# Altium schematic sheet inverter_sch.SchDoc
size A3
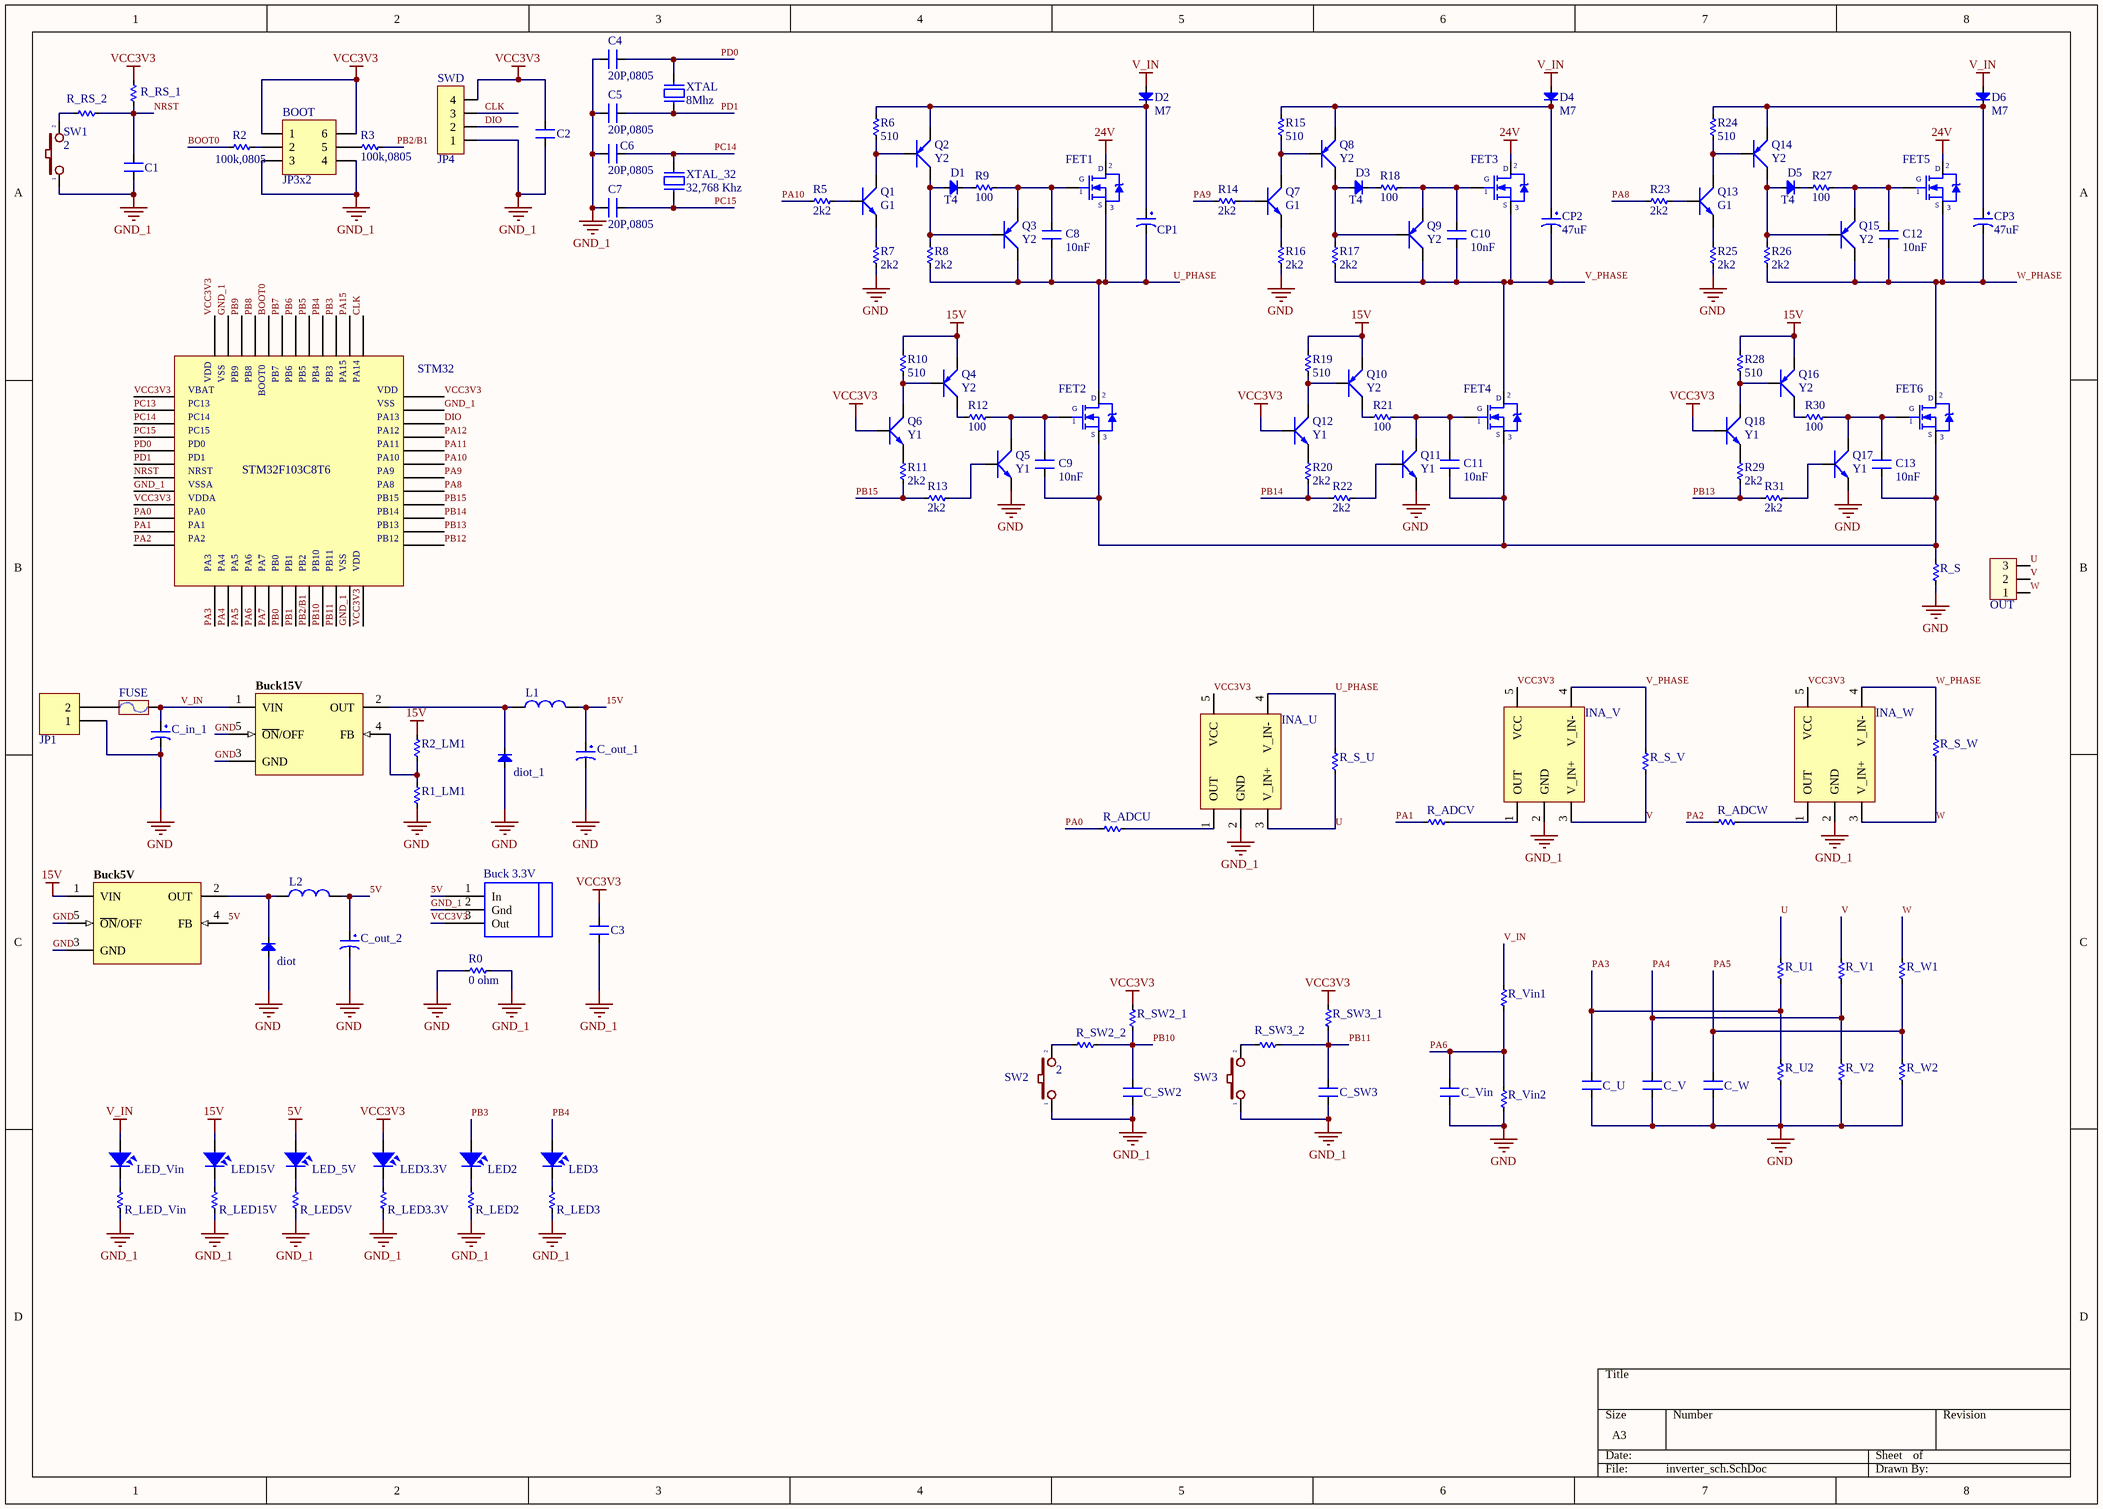
[diagram p0: inverter_sch.SchDoc]

## Parts
BOOT  JP3x2  [JP3-D2T]
Buck5V  LM2576  [TO263]  (value not drawn)
Buck15V  LM2576  [TO263]  (value not drawn)
Buck_3.3V  LM3940-3.3  [SOT223]  (value not drawn)
C1  104,0805  [CN-SMD-0805]  (value not drawn)
C2  104,0805  [CN-SMD-0805]  (value not drawn)
C3  104,0805  [CN-SMD-0805]  (value not drawn)
C4  20P,0805  [CN-SMD-0805]
C5  20P,0805  [CN-SMD-0805]
C6  20P,0805  [CN-SMD-0805]
C7  20P,0805  [CN-SMD-0805]
C8  10nF  [CN-SMD-0805]
C9  10nF  [CN-SMD-0805]
C10  10nF  [CN-SMD-0805]
C11  10nF  [CN-SMD-0805]
C12  10nF  [CN-SMD-0805]
C13  10nF  [CN-SMD-0805]
C_in_1  100uF  [CP1.5/3.4]  (value not drawn)
C_out_1  100uF  [CP1.5/3.4]  (value not drawn)
C_out_2  100uF  [CP1.5/3.4]  (value not drawn)
C_SW2  104,0805  [CN-SMD-0805]  (value not drawn)
C_SW3  104,0805  [CN-SMD-0805]  (value not drawn)
C_U  XXpF  [CN-SMD-0805]  (value not drawn)
C_V  XXpF  [CN-SMD-0805]  (value not drawn)
C_Vin  XXpF  [CN-SMD-0805]  (value not drawn)
C_W  XXpF  [CN-SMD-0805]  (value not drawn)
CP1  47uF  [CP1/2]  (value not drawn)
CP2  47uF  [CP1/2]
CP3  47uF  [CP1/2]
D1  T4  [DIO-SMD-106]
D2  M7  [DIO-SMD-106]
D3  T4  [DIO-SMD-106]
D4  M7  [DIO-SMD-106]
D5  T4  [DIO-SMD-106]
D6  M7  [DIO-SMD-106]
diot  Diode SMD  [DIO-SMD-106]  (value not drawn)
diot_1  Diode SMD  [DIO-SMD-106]  (value not drawn)
FET1  STP80NF70  [QTO-220]  (value not drawn)
FET2  STP80NF70  [QTO-220]  (value not drawn)
FET3  STP80NF70  [QTO-220]  (value not drawn)
FET4  STP80NF70  [QTO-220]  (value not drawn)
FET5  STP80NF70  [QTO-220]  (value not drawn)
FET6  STP80NF70  [QTO-220]  (value not drawn)
FUSE  F1A  [Fuse1]  (value not drawn)
INA_U  INA193_4_5  [SOT95_SOT23]  (value not drawn)
INA_V  INA193_4_5  [SOT95_SOT23]  (value not drawn)
INA_W  INA193_4_5  [SOT95_SOT23]  (value not drawn)
JP1  Header 2_1  [HED2]  (value not drawn)
L1  100mH  [L/0.4]  (value not drawn)
L2  100mH  [L/0.4]  (value not drawn)
LED2  power 0805  [LED-0805-Blue]  (value not drawn)
LED3  power 0805  [LED-0805-Blue]  (value not drawn)
LED3.3V  power 0805  [LED-0805-Blue]  (value not drawn)
LED15V  power 0805  [LED-0805-Blue]  (value not drawn)
LED_5V  power 0805  [LED-0805-Blue]  (value not drawn)
LED_Vin  power 0805  [LED-0805-Blue]  (value not drawn)
OUT  Header 3  [HED3B]  (value not drawn)
Q1  G1  [SOT23B]
Q2  Y2  [SOT23B]
Q3  Y2  [SOT23B]
Q4  Y2  [SOT23B]
Q5  Y1  [SOT23B]
Q6  Y1  [SOT23B]
Q7  G1  [SOT23B]
Q8  Y2  [SOT23B]
Q9  Y2  [SOT23B]
Q10  Y2  [SOT23B]
Q11  Y1  [SOT23B]
Q12  Y1  [SOT23B]
Q13  G1  [SOT23B]
Q14  Y2  [SOT23B]
Q15  Y2  [SOT23B]
Q16  Y2  [SOT23B]
Q17  Y1  [SOT23B]
Q18  Y1  [SOT23B]
R0  0 ohm  [RES-SMD-1206]
R1_LM1  Res  [RES-SMD-0805]  (value not drawn)
R2  100k,0805  [RES-SMD-0805]
R2_LM1  Res  [RES-SMD-0805]  (value not drawn)
R3  100k,0805  [RES-SMD-0805]
R5  2k2  [RES-SMD-0805]
R6  510  [RES-SMD-0805]
R7  2k2  [RES-SMD-0805]
R8  2k2  [RES-SMD-0805]
R9  100  [RES-SMD-0805]
R10  510  [RES-SMD-0805]
R11  2k2  [RES-SMD-0805]
R12  100  [RES-SMD-0805]
R13  2k2  [RES-SMD-0805]
R14  2k2  [RES-SMD-0805]
R15  510  [RES-SMD-0805]
R16  2k2  [RES-SMD-0805]
R17  2k2  [RES-SMD-0805]
R18  100  [RES-SMD-0805]
R19  510  [RES-SMD-0805]
R20  2k2  [RES-SMD-0805]
R21  100  [RES-SMD-0805]
R22  2k2  [RES-SMD-0805]
R23  2k2  [RES-SMD-0805]
R24  510  [RES-SMD-0805]
R25  2k2  [RES-SMD-0805]
R26  2k2  [RES-SMD-0805]
R27  100  [RES-SMD-0805]
R28  510  [RES-SMD-0805]
R29  2k2  [RES-SMD-0805]
R30  100  [RES-SMD-0805]
R31  2k2  [RES-SMD-0805]
R_ADCU  Res  [RES-SMD-0805]  (value not drawn)
R_ADCV  Res  [RES-SMD-0805]  (value not drawn)
R_ADCW  Res  [RES-SMD-0805]  (value not drawn)
R_LED2  510,0805  [RES-SMD-0805]  (value not drawn)
R_LED3  510,0805  [RES-SMD-0805]  (value not drawn)
R_LED3.3V  510,0805  [RES-SMD-0805]  (value not drawn)
R_LED5V  510,0805  [RES-SMD-0805]  (value not drawn)
R_LED15V  510,0805  [RES-SMD-0805]  (value not drawn)
R_LED_Vin  510,0805  [RES-SMD-0805]  (value not drawn)
R_RS_1  10k,0805  [RES-SMD-0805]  (value not drawn)
R_RS_2  10k,0805  [RES-SMD-0805]  (value not drawn)
R_S  Res  [RES-SMD-2512]  (value not drawn)
R_S_U  Res  [RES-SMD-2512]  (value not drawn)
R_S_V  Res  [RES-SMD-2512]  (value not drawn)
R_S_W  Res  [RES-SMD-2512]  (value not drawn)
R_SW2_1  10k,0805  [RES-SMD-0805]  (value not drawn)
R_SW2_2  10k,0805  [RES-SMD-0805]  (value not drawn)
R_SW3_1  10k,0805  [RES-SMD-0805]  (value not drawn)
R_SW3_2  10k,0805  [RES-SMD-0805]  (value not drawn)
R_U1  Res  [RES-SMD-0805]  (value not drawn)
R_U2  Res  [RES-SMD-0805]  (value not drawn)
R_V1  Res  [RES-SMD-0805]  (value not drawn)
R_V2  Res  [RES-SMD-0805]  (value not drawn)
R_Vin1  Res  [RES-SMD-0805]  (value not drawn)
R_Vin2  Res  [RES-SMD-0805]  (value not drawn)
R_W1  Res  [RES-SMD-0805]  (value not drawn)
R_W2  Res  [RES-SMD-0805]  (value not drawn)
STM32  STM32F103C8T6  [LQFP 48]  (value not drawn)
SW1  2  [SW1-SMD]
SW2  2  [SW1-SMD]
SW3  2  [SW1-SMD]  (value not drawn)
SWD  JP4  [JP4-C1T]
XTAL  8Mhz  [XT2]
XTAL_32  32,768 Khz  [XT32k]

## Nets
5V: Buck5V.4(FB) Buck_3.3V.1(In) C_out_2.1 L2.2 LED_5V.1
15V: Buck5V.1(VIN) C_out_1.1 L1.2 LED15V.1 Q4.1(E) Q10.1(E) Q16.1(E) R2_LM1.1 R10.1 R19.1 R28.1
24V: FET1.2(D) FET3.2(D) FET5.2(D)
GND: Buck5V.3(GND) Buck5V.5(~{ON}/OFF) Buck15V.3(GND) Buck15V.5(~{ON}/OFF) C_in_1.2 C_out_1.2 C_out_2.2 C_U.1 C_V.1 C_Vin.1 C_W.1 diot.1(A) diot_1.1(A) JP1.1 Q5.1(E) Q11.1(E) Q17.1(E) R0.1 R1_LM1.2 R7.2 R16.2 R25.2 R_S.2 R_U2.2 R_V2.2 R_Vin2.2 R_W2.2
GND_1: BOOT.3 BOOT.4 Buck_3.3V.2(Gnd) C1.1 C2.1 C3.1 C4.2 C5.2 C6.2 C7.2 C_SW2.1 C_SW3.1 INA_U.2(GND) INA_V.2(GND) INA_W.2(GND) R0.2 R_LED2.2 R_LED3.2 R_LED3.3V.2 R_LED5V.2 R_LED15V.2 R_LED_Vin.2 STM32.8 STM32.23 STM32.35 STM32.47 SW1.1 SW2.1 SW3.1 SWD.1
V_IN: Buck15V.1(VIN) C_in_1.1 D2.1(A) D4.1(A) D6.1(A) FUSE.2 LED_Vin.1 R_Vin1.1
VCC3V3: BOOT.1 BOOT.6 Buck_3.3V.3(Out) C2.2 C3.2 INA_U.5(VCC) INA_V.5(VCC) INA_W.5(VCC) LED3.3V.1 Q6.3(B) Q12.3(B) Q18.3(B) R_RS_1.1 R_SW2_1.1 R_SW3_1.1 STM32.1 STM32.9 STM32.24 STM32.36 STM32.48 SWD.4
BOOT0: R2.1 STM32.44
CLK: STM32.37 SWD.3
DIO: STM32.34 SWD.2
NRST: C1.2 R_RS_1.2 R_RS_2.1 STM32.7
PA0: R_ADCU.2 STM32.10
PA1: R_ADCV.2 STM32.11
PA2: R_ADCW.2 STM32.12
PA3: C_U.2 R_U1.2 R_U2.1 STM32.13
PA4: C_V.2 R_V1.2 R_V2.1 STM32.14
PA5: C_W.2 R_W1.2 R_W2.1 STM32.15
PA6: C_Vin.2 R_Vin1.2 R_Vin2.1 STM32.16
PA7: STM32.17
PA8: R23.2 STM32.29
PA9: R14.2 STM32.30
PA10: R5.2 STM32.31
PA11: STM32.32
PA12: STM32.33
PA15: STM32.38
PB0: STM32.18
PB1: STM32.19
PB2/B1: R3.1 STM32.20
PB3: LED2.1 STM32.39
PB4: LED3.1 STM32.40
PB5: STM32.41
PB6: STM32.42
PB7: STM32.43
PB8: STM32.45
PB9: STM32.46
PB10: C_SW2.2 R_SW2_1.2 R_SW2_2.2 STM32.21
PB11: C_SW3.2 R_SW3_1.2 R_SW3_2.2 STM32.22
PB12: STM32.25
PB13: R29.2 R31.1 STM32.26
PB14: R20.2 R22.1 STM32.27
PB15: R11.2 R13.1 STM32.28
PC13: STM32.2
PC14: C6.1 STM32.3 XTAL_32.2
PC15: C7.1 STM32.4 XTAL_32.1
PD0: C4.1 STM32.5 XTAL.2
PD1: C5.1 STM32.6 XTAL.1
U: INA_U.3(V_IN+) OUT.3 R_S_U.2 R_U1.1
U_PHASE: C8.2 CP1.2 FET1.3(S) FET2.2(D) INA_U.4(V_IN-) Q3.2(C) R8.2 R_S_U.1
V: INA_V.3(V_IN+) OUT.2 R_S_V.2 R_V1.1
V_PHASE: C10.2 CP2.2 FET3.3(S) FET4.2(D) INA_V.4(V_IN-) Q9.2(C) R17.2 R_S_V.1
W: INA_W.3(V_IN+) OUT.1 R_S_W.2 R_W1.1
W_PHASE: C12.2 CP3.2 FET5.3(S) FET6.2(D) INA_W.4(V_IN-) Q15.2(C) R26.2 R_S_W.1
NetBOOT_2: BOOT.2 R2.2
NetBOOT_5: BOOT.5 R3.2
NetBuck5V_2: Buck5V.2(OUT) diot.2(K) L2.1
NetBuck15V_2: Buck15V.2(OUT) diot_1.2(K) L1.1
NetBuck15V_4: Buck15V.4(FB) R1_LM1.1 R2_LM1.2
NetC8_1: C8.1 FET1.1(G) Q3.1(E) R9.2
NetC9_1: C9.1 FET2.1(G) Q5.2(C) R12.2
NetC9_2: C9.2 C11.2 C13.2 FET2.3(S) FET4.3(S) FET6.3(S) R_S.1
NetC10_1: C10.1 FET3.1(G) Q9.1(E) R18.2
NetC11_1: C11.1 FET4.1(G) Q11.2(C) R21.2
NetC12_1: C12.1 FET5.1(G) Q15.1(E) R27.2
NetC13_1: C13.1 FET6.1(G) Q17.2(C) R30.2
NetCP1_1: CP1.1 D2.2(K) Q2.1(E) R6.1
NetCP2_1: CP2.1 D4.2(K) Q8.1(E) R15.1
NetCP3_1: CP3.1 D6.2(K) Q14.1(E) R24.1
NetD1_1: D1.1(A) Q2.2(C) Q3.3(B) R8.1
NetD1_2: D1.2(K) R9.1
NetD3_1: D3.1(A) Q8.2(C) Q9.3(B) R17.1
NetD3_2: D3.2(K) R18.1
NetD5_1: D5.1(A) Q14.2(C) Q15.3(B) R26.1
NetD5_2: D5.2(K) R27.1
NetFUSE_1: FUSE.1 JP1.2
NetINA_U_1: INA_U.1(OUT) R_ADCU.1
NetINA_V_1: INA_V.1(OUT) R_ADCV.1
NetINA_W_1: INA_W.1(OUT) R_ADCW.1
NetLED2_2: LED2.2 R_LED2.1
NetLED3.3V_2: LED3.3V.2 R_LED3.3V.1
NetLED3_2: LED3.2 R_LED3.1
NetLED15V_2: LED15V.2 R_LED15V.1
NetLED_5V_2: LED_5V.2 R_LED5V.1
NetLED_Vin_2: LED_Vin.2 R_LED_Vin.1
NetQ1_1: Q1.1(E) R7.1
NetQ1_2: Q1.2(C) Q2.3(B) R6.2
NetQ1_3: Q1.3(B) R5.1
NetQ4_2: Q4.2(C) R12.1
NetQ4_3: Q4.3(B) Q6.2(C) R10.2
NetQ5_3: Q5.3(B) R13.2
NetQ6_1: Q6.1(E) R11.1
NetQ7_1: Q7.1(E) R16.1
NetQ7_2: Q7.2(C) Q8.3(B) R15.2
NetQ7_3: Q7.3(B) R14.1
NetQ10_2: Q10.2(C) R21.1
NetQ10_3: Q10.3(B) Q12.2(C) R19.2
NetQ11_3: Q11.3(B) R22.2
NetQ12_1: Q12.1(E) R20.1
NetQ13_1: Q13.1(E) R25.1
NetQ13_2: Q13.2(C) Q14.3(B) R24.2
NetQ13_3: Q13.3(B) R23.1
NetQ16_2: Q16.2(C) R30.1
NetQ16_3: Q16.3(B) Q18.2(C) R28.2
NetQ17_3: Q17.3(B) R31.2
NetQ18_1: Q18.1(E) R29.1
NetR_RS_2_2: R_RS_2.2 SW1.2
NetR_SW2_2_1: R_SW2_2.1 SW2.2
NetR_SW3_2_1: R_SW3_2.1 SW3.2

## Notes on the sheet
- (in symbol STM32F103C8T6) VDD; VSS; PB9; PB8; PB7; PB6; PB5; PB4; PB3; PA15; PA14; VBAT; BOOT0; PC13; PC14; PA13; PC15; PA12; PD0; PA11; PD1; PA10; NRST; PA9; VSSA; PA8; VDDA; PB15; PA0; PB14; PA1; PB13; PA2; PB12; PA3; PA4; PA5; PA6; PA7; PB0; PB1; PB2; PB10; PB11

## Library data of the parts
BOOT = JP3x2: WR-PHD 2.54 mm Dual Socket Header; Manufacturer: W¨¹rth Elektronik eiSos GmbH; partNo: 61300621821; ComponentLink1 Description: Manufacturer; ComponentLink2 Description: Datasheet; NoPins: 06; Created Date: 29 March 2013; ComponentLink1URL: http://www.we-online.com; ComponentLink2URL: http://katalog.we-online.de/em/datasheet/6130xx21821.pdf; Created by: Karrer Zheng
Buck5V Buck15V = LM2576: Max Input Voltage: 12 V; Max Output Current: 3 (6.0 peak) A; Max Output Voltage: mV; Category: IC-Power; Min Input Voltage: mV; Min Output Voltage: mV; Mounting Technology: Surface Mount; Status: Unreleased; Supply Voltage: mV; Temperature Range: -40 to +125 degC
Buck_3.3V = LM3940-3.3-SOT223: 3.3 VOLT LINEAR REGULATOR SOT223; Manufacturer: National Semiconductor; Manufacturer Part Number: LM3940IMP-3.3/NOPB; Number of Regulators: 1; Regulator Topology: Positive Fixed; Voltage - Output: 3.3V; Current - Output: 1A; Voltage - Input: 4.5 ~ 5.5 V; Voltage - Dropout (Typical): 0.11V @ 100mA; Supplier 1: Digi-Key; Supplier Part Number 1: LM3940IMP-3.3DKR-ND; Package / Case: SOT-223 (3 leads + Tab), SC-73, TO-261AA; Operating Temperature: -40°C ~ 125°C; Supplier Part Number: LM3940IMP-3.3DKR-ND; Supplier: Digi-Key; Current - Limit (Min): -; Packaging: Digi-Reel®; RoHS: RoHS Compliant; Category: Integrated Circuits (ICs)
C1-C13 C_SW2 C_SW3 C_U C_V C_Vin C_W = CN: Value: 33pF
C_in_1 C_out_1 C_out_2 = CP4: Cap 1000uF/16V - 220uF/50V; Description 5: 4,7uF>10uF/250V_3,3uF>10uF/400V - 2,2uF>4,7uF/450V; Description 1: 2200uF-3300uF/6,3V - 1000uF-2200uF/10V; Description 2: 1000uF/16V - 470uF => 1000uF/25V - 100uF/100V; Description 3: 330uF>470uF/35V_220uF>470uF/50V_10uF>22uF/250V; Description 4: 220uF => 330uF/63V - 10uF =>33uF/160 - 200V; Value: 1000uF/16V
CP1-CP3 = CP1: Cap P  0,1uF < 22uF , 16 - 50V; Value: 10uF/50V; Description 1: 10 => 220uF/6,3V/10V - 10uF => 100uF/16V; Description 2: 0,1uF => 33uF/50V - 10uF => 22uF/63V; Description 3: 0,47uF => 10uF/100V
D1-D6 diot diot_1 = Diode SMD: Default Diode; Code - JEDEC: DO-214-AB; Value: 1N5007; Published: 8-Jun-2000; Revision: July-2002: Re-released for DXP Platform.; Publisher: Altium Limited
FET1-FET6 = IRF840: MOSFET N - CHANNEL 500V - 0.75 - 8A - TO-220; Value: IRF840
FUSE = Fuse: Designed by: VanDungEvn; Value: Fuse
JP1 = Header 2_1: Header, 2-Pin; Manufacturer: Generic Components; Class: Connector; Value: Header 2
L1 L2 = L1: Inductor; Value: 150 mH
LED2 LED3 LED3.3V LED15V LED_5V LED_Vin = LED SMD: Value: LED 3 - 5 ly 2 Colour
OUT = Hed3: Header 3 (Green); Value: Header 3
Q1 Q5-Q7 Q11-Q13 Q17 Q18 = C1815: NPN 600mW, ECB; Value: C1815
Q2-Q4 Q8-Q10 Q14-Q16 = A1015: PNP 600mW, ECB; Value: A1015
R0 R1_LM1 R2 R2_LM1 R3 R5-R31 R_ADCU R_ADCV R_ADCW R_LED2 R_LED3 R_LED3.3V R_LED5V R_LED15V R_LED_Vin R_RS_1 R_RS_2 R_S R_S_U R_S_V R_S_W R_SW2_1 R_SW2_2 R_SW3_1 R_SW3_2 R_U1 R_U2 R_V1 R_V2 R_Vin1 R_Vin2 R_W1 R_W2 = Res-SMD: Resistor; Manufacturer: Generic Components; Class: Passive; Published: 08/06/2000; Publisher: Altium Hobart Technology Centre
STM32 = STM32F103C8T6: Manufacturer: STMicroelectronics; Family Name: STM32F; Device Core: ARM Cortex M3; Data Bus Width: 32bit; Program Memory Size: 64 kB; Maximum Frequency: 72MHz; RAM Size: 20 kB; USB Channels: 1 x Device; Number of PWM Units: 1; ADC Channels: 10; Number of SPI Channels: 2; Typical Operating Supply Voltage: 2 → 3.6 V; Pulse Width Modulation: 1(16 bit) (Motor Control); Timers: 3 x 16 bit; Timer Resolution: 16bit; ADC Resolution: 12bit; Number of Timers: 3; ADCs: 2(10 x 12 bit); Instruction Set Architecture: RISC; Program Memory Type: Flash; Supplier 1: Digi-Key; Manufacturer Part Number: STM32F103C8T6; Stock 1: 2374; Pricing 1: 1=6.06, 10=5.438, 250=4.2272, 500=3.7931, 1000=3.199 (USD); Package Type: LQFP; Mounting Type: Surface Mount; Pin Count: 48; Length: 7.2mm; Dimensions: 7.2 x 7.2 x 1.45mm; Number of ADC Units: 2; Number of USART Channels: 3; PWM Resolution: 16bit; Height: 1.45mm; Maximum Operating Temperature: +85 °C; Number of I2C Channels: 2; Width: 7.2mm; Minimum Operating Temperature: -40 °C; Number of CAN Channels: 1; ComponentLink1URL: http://www.st.com/web/en/resource/technical/document/datasheet/CD00161566.pdf?src-supplier=Future+Electronics; ComponentLink1Description: http://www.st.com/web/en/resource/technical/document/datasheet/CD00161566.pdf?src-supplier=Future+Electronics; ComponentLink2URL: https://www.distrelec.biz/Web/Downloads/3_/en/puSTM_ARM-MicroCont-STM32F103_EN.pdf?mime=application%2Fpdf&src-supplier=Distrelec; ComponentLink2Description: https://www.distrelec.biz/Web/Downloads/3_/en/puSTM_ARM-MicroCont-STM32F103_EN.pdf?mime=application%2Fpdf&src-supplier=Distrelec; ComponentLink3URL: https://www.verical.com/server-webapp/html/getDatasheet?partID=69880&src-supplier=Verical; ComponentLink3Description: https://www.verical.com/server-webapp/html/getDatasheet?partID=69880&src-supplier=Verical; ComponentLink4URL: http://www.farnell.com/datasheets/1730126.pdf?src-supplier=Element14; ComponentLink4Description: http://www.farnell.com/datasheets/1730126.pdf?src-supplier=Element14; ComponentLink5URL: http://www.produktinfo.conrad.com/datenblaetter/1000000-1099999/001075658-da-01-en-MCU_64KB_MEM_STM32F103C8T6_LQFP_48_STM.pdf?src-supplier=Conrad; ComponentLink5Description: http://www.produktinfo.conrad.com/datenblaetter/1000000-1099999/001075658-da-01-en-MCU_64KB_MEM_STM32F103C8T6_LQFP_48_STM.pdf?src-supplier=Conrad; ComponentLink6URL: http://datasheet.iiic.cc/stmicroelectronics/STM32F103C8T6.pdf?src-supplier=IIIC; ComponentLink6Description: http://datasheet.iiic.cc/stmicroelectronics/STM32F103C8T6.pdf?src-supplier=IIIC; Supplier Part Number 1: 497-6063-ND
SW1-SW3 = SW2: Switch button 2 pin; Value: SW chip 2 pin
SWD = JP4: WR-PHD 2.54 mm Angled Socket Header; Manufacturer: W¨¹rth Elektronik eiSos GmbH; partNo: 613004143121; ComponentLink1 Description: Manufacturer; ComponentLink2 Description: Datasheet; NoPins: 04; Created Date: 29 March 2013; ComponentLink1URL: http://www.we-online.com; ComponentLink2URL: http://katalog.we-online.de/em/datasheet/6130xx143121.pdf; Created by: Karrer Zheng
XTAL = XT2: Crystal, 32.768 KHz, -40 to 85 degC, 3.2 x 1.5 x 0.9 mm SMD; Value: 4Mhz
XTAL_32 = XT32k: Crystal 32,768kHz for timer real; Value: 32,768khz
INA_U INA_V INA_W = INA193_4_5: Supplier 1: Digi-Key; INA193: INA193